# Altium schematic sheet CH571_Core.SchDoc
size A4
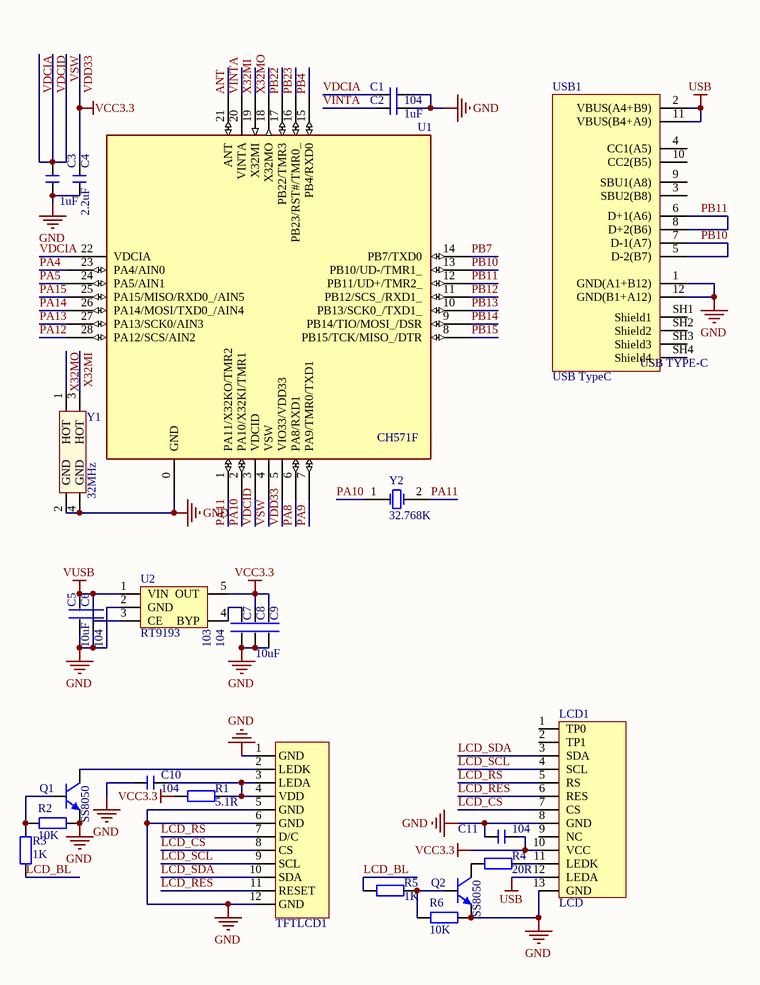
[diagram p0: CH571_Core.SchDoc]

## Parts
C1  104  [C 0603_L]
C2  1uF  [C 0603_L]
C3  1uF  [C 0603_L]
C4  2.2uF  [C 0603_L]
C5  10uF  [C 0603_L]
C6  104  [C 0603_L]
C7  103  [C 0603_L]
C8  104  [C 0603_L]
C9  10uF  [C 0603_L]
C10  104  [C 0603_L]
C11  104  [C 0603_L]
LCD1  LCD  [0.96LCD]
Q1  SS8050  [SOT23-3L]
Q2  SS8050  [SOT23-3N]
R1  5.1R  [R 0805_L]
R2  10K  [R 0603_L]
R3  1K  [R 0603_L]
R4  20R  [R 0603_L]
R5  1K  [R 0603_L]
R6  10K  [R 0603_L]
TFTLCD1  TFTLCD-N133-2424THBIG01  [TFT-N133-2424THBIG01]  (value not drawn)
U1  CH571F  [QFN28_4X4]
U2  RT9193  [SOT23-5L]
USB1  USB TypeC  [USB2.0 Type-C]
Y1  32MHz  [OSC 3225-4P]
Y2  32.768K  [OSC 3215-2P]

## Nets
GND: C1.2 C2.2 C3.2 C4.2 C5.1 C6.1 C7.1 C8.1 C9.1 C10.2 C11.2 LCD1.8(GND) LCD1.13(GND) Q1.2(E) Q2.2(E) R2.2 R6.2 TFTLCD1.1(GND) TFTLCD1.5(GND) TFTLCD1.6(GND) TFTLCD1.12(GND) U1.0(GND) U2.2(GND) USB1.1(GND(A1+B12)) USB1.12(GND(B1+A12)) Y1.2(GND) Y1.4(GND)
USB: LCD1.12(LEDA) USB1.2(VBUS(A4+B9)) USB1.11(VBUS(B4+A9))
VDD33: C4.1 C8.2 C9.2 C11.1 LCD1.10(VCC) R1.1 U1.5(VIO33/VDD33) U2.5(OUT)  [also labelled VCC3.3]
VUSB: C5.2 C6.2 U2.1(VIN) U2.3(CE)
ANT: U1.21(ANT)
LCD_BL: R3.1 R5.1
LCD_CS: LCD1.7(CS) TFTLCD1.8(CS)
LCD_RES: LCD1.6(RES) TFTLCD1.11(RESET)
LCD_RS: LCD1.5(RS) TFTLCD1.7(D/C)
LCD_SCL: LCD1.4(SCL) TFTLCD1.9(SCL)
LCD_SDA: LCD1.3(SDA) TFTLCD1.10(SDA)
PA4: U1.23(PA4/AIN0)
PA5: U1.24(PA5/AIN1)
PA8: U1.6(PA8/RXD1)
PA9: U1.7(PA9/TMR0/TXD1)
PA10: U1.2(PA10/X32KI/TMR1) Y2.1(OSC1)
PA11: U1.1(PA11/X32KO/TMR2) Y2.2(OSC2)
PA12: U1.28(PA12/SCS/AIN2)
PA13: U1.27(PA13/SCK0/AIN3)
PA14: U1.26(PA14/MOSI/TXD0_/AIN4)
PA15: U1.25(PA15/MISO/RXD0_/AIN5)
PB4: U1.15(PB4/RXD0)
PB7: U1.14(PB7/TXD0)
PB10: U1.13(PB10/UD-/TMR1_) USB1.5(D-2(B7)) USB1.7(D-1(A7))
PB11: U1.12(PB11/UD+/TMR2_) USB1.6(D+1(A6)) USB1.8(D+2(B6))
PB12: U1.11(PB12/SCS_/RXD1_)
PB13: U1.10(PB13/SCK0_/TXD1_)
PB14: U1.9(PB14/TIO/MOSI_/DSR)
PB15: U1.8(PB15/TCK/MISO_/DTR)
PB22: U1.17(PB22/TMR3)
PB23: U1.16(PB23/RST#/TMR0_)
VDCIA: C1.1 C3.1 U1.3(VDCID) U1.4(VSW) U1.22(VDCIA)  [also labelled VDCID, VSW]
VINTA: C2.1 U1.20(VINTA)
X32MI: U1.19(X32MI) Y1.3(HOT)
X32MO: U1.18(X32MO) Y1.1(HOT)
NetC7_2: C7.2 U2.4(BYP)
NetC10_1: C10.1 R1.2 TFTLCD1.3(LEDA) TFTLCD1.4(VDD)
NetLCD1_11: LCD1.11(LEDK) R4.2
NetQ1_1: Q1.1(B) R2.1 R3.2
NetQ1_3: Q1.3(C) TFTLCD1.2(LEDK)
NetQ2_1: Q2.1(B) R5.2 R6.1
NetQ2_3: Q2.3(C) R4.1

Not connected (* = marked no-connect by the designer): LCD1 1(TP0) 2(TP1) 9(NC); USB1 3(SBU2(B8)) 4(CC1(A5)) 9(SBU1(A8)) 10(CC2(B5)) SH1(Shield1) SH2(Shield2) SH3(Shield3) SH4(Shield4)

## Notes on the sheet
- (in symbol USB 2.0 Type C) USB TYPE-C

## Library data of the parts
C1-C4 = C: 无极性贴片电容; BOM名称: 无极性贴片电容
C5-C9 = C
C10 C11 = C: 无极性电容; BOM名称: 无极性贴片电容; 版权归属: 正点原子; 学习资源: www.openedv.com
LCD1 = LCD 0.96: 0.96 LCD 80*160; BOM名称: 12864 点阵屏; 版权归属: 正点原子; Parameter: 显示器件; 学习资源: www.openedv.com
Q1 Q2 = 8050-SMD: 高频放大-NPN型; 版权归属: 正点原子; 属性: 40V 1.5A 1W 100MHZ; Parameter: 三极管; BOM名称: 高频放大-NPN型; 学习资源: www.openedv.com
R1-R6 = R: 贴片电阻
TFTLCD1 = TFTLCD-N133-2424THBIG01: TFTLCD,240*240,SPI
U1 = CH571F: RISC-V MCU with BLE/USB/ADC/SPI/2*UART
U2 = CAT6219-330TD: 3.3V 500mA LDO
USB1 = USB 2.0 Type C: 12P TypeC 母座; 版权归属: 正点原子; Parameter: 接口器件; 学习资源: www.openedv.com
Y1 = Y-3225-4P: 晶振25MHz; Published: 8-Jun-2000; LatestRevisionDate: 17-Jul-2002; LatestRevisionNote: Re-released for DXP Platform.; Publisher: Altium Limited
Y2 = Y-3215-2P: 晶振32.768K; Published: 8-Jun-2000; LatestRevisionDate: 17-Jul-2002; LatestRevisionNote: Re-released for DXP Platform.; Publisher: Altium Limited